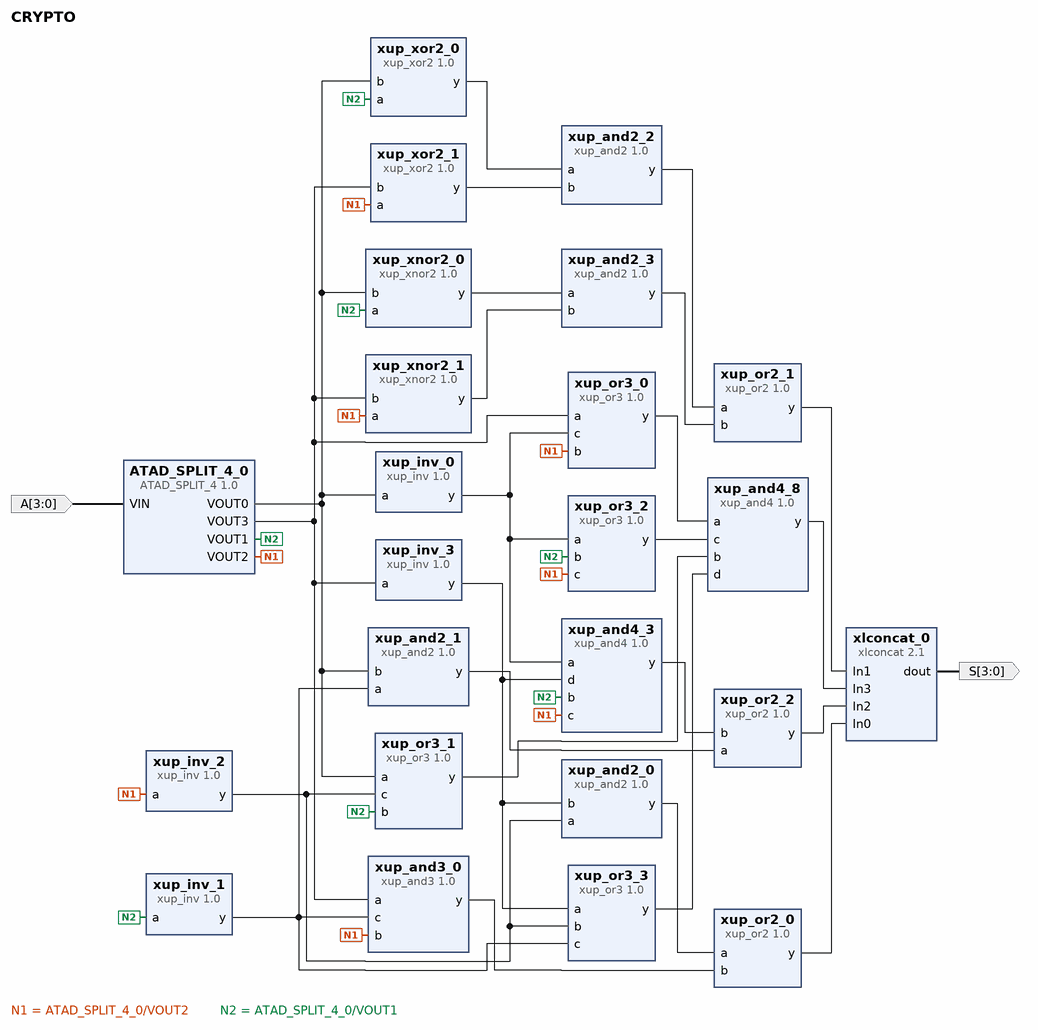
[diagram p0: block diagram of the top level]
# Vivado block design CRYPTO, xc7a100tcsg324-1, Vivado 2020.1
create_bd_design CRYPTO

create_bd_port -dir I -from 3 -to 0 A
create_bd_port -dir O -from 3 -to 0 S

create_bd_cell -type ip -vlnv xilinx.com:user:ATAD_SPLIT_4:1.0 ATAD_SPLIT_4_0
create_bd_cell -type ip -vlnv xilinx.com:ip:xlconcat:2.1 xlconcat_0
set_property -dict {CONFIG.NUM_PORTS 4} [get_bd_cells xlconcat_0]
create_bd_cell -type ip -vlnv xilinx.com:xup:xup_or2:1.0 xup_or2_0
create_bd_cell -type ip -vlnv xilinx.com:xup:xup_and2:1.0 xup_and2_0
create_bd_cell -type ip -vlnv xilinx.com:xup:xup_and3:1.0 xup_and3_0
create_bd_cell -type ip -vlnv xilinx.com:xup:xup_inv:1.0 xup_inv_0
create_bd_cell -type ip -vlnv xilinx.com:xup:xup_inv:1.0 xup_inv_1
create_bd_cell -type ip -vlnv xilinx.com:xup:xup_inv:1.0 xup_inv_2
create_bd_cell -type ip -vlnv xilinx.com:xup:xup_inv:1.0 xup_inv_3
create_bd_cell -type ip -vlnv xilinx.com:xup:xup_and4:1.0 xup_and4_3
create_bd_cell -type ip -vlnv xilinx.com:xup:xup_and2:1.0 xup_and2_1
create_bd_cell -type ip -vlnv xilinx.com:xup:xup_or2:1.0 xup_or2_2
create_bd_cell -type ip -vlnv xilinx.com:xup:xup_and4:1.0 xup_and4_8
create_bd_cell -type ip -vlnv xilinx.com:xup:xup_or3:1.0 xup_or3_0
create_bd_cell -type ip -vlnv xilinx.com:xup:xup_or3:1.0 xup_or3_1
create_bd_cell -type ip -vlnv xilinx.com:xup:xup_or3:1.0 xup_or3_2
create_bd_cell -type ip -vlnv xilinx.com:xup:xup_or3:1.0 xup_or3_3
create_bd_cell -type ip -vlnv xilinx.com:xup:xup_xor2:1.0 xup_xor2_0
create_bd_cell -type ip -vlnv xilinx.com:xup:xup_xor2:1.0 xup_xor2_1
create_bd_cell -type ip -vlnv xilinx.com:xup:xup_xnor2:1.0 xup_xnor2_0
create_bd_cell -type ip -vlnv xilinx.com:xup:xup_xnor2:1.0 xup_xnor2_1
create_bd_cell -type ip -vlnv xilinx.com:xup:xup_or2:1.0 xup_or2_1
create_bd_cell -type ip -vlnv xilinx.com:xup:xup_and2:1.0 xup_and2_2
create_bd_cell -type ip -vlnv xilinx.com:xup:xup_and2:1.0 xup_and2_3

# ---- connections ----

connect_bd_net [get_bd_pins xup_or2_0/y] [get_bd_pins xlconcat_0/In0]
connect_bd_net [get_bd_pins xup_and2_0/y] [get_bd_pins xup_or2_0/a]
connect_bd_net [get_bd_pins xup_and3_0/y] [get_bd_pins xup_or2_0/b]
connect_bd_net [get_bd_ports A] [get_bd_pins ATAD_SPLIT_4_0/VIN]
connect_bd_net [get_bd_pins ATAD_SPLIT_4_0/VOUT3] \
  [get_bd_pins xup_inv_3/a] [get_bd_pins xup_and3_0/a] [get_bd_pins xup_or3_0/a] [get_bd_pins xup_xor2_1/b] \
  [get_bd_pins xup_xnor2_1/b]
connect_bd_net [get_bd_pins ATAD_SPLIT_4_0/VOUT2] \
  [get_bd_pins xup_inv_2/a] [get_bd_pins xup_and3_0/b] [get_bd_pins xup_and4_3/c] [get_bd_pins xup_or3_0/b] \
  [get_bd_pins xup_or3_2/c] [get_bd_pins xup_xor2_1/a] [get_bd_pins xup_xnor2_1/a]
connect_bd_net [get_bd_pins xup_inv_3/y] [get_bd_pins xup_and2_0/b] [get_bd_pins xup_and4_3/d] [get_bd_pins xup_or3_3/a]
connect_bd_net [get_bd_pins xup_inv_2/y] [get_bd_pins xup_and2_0/a] [get_bd_pins xup_or3_1/c] [get_bd_pins xup_or3_3/b]
connect_bd_net [get_bd_pins ATAD_SPLIT_4_0/VOUT1] \
  [get_bd_pins xup_inv_1/a] [get_bd_pins xup_and4_3/b] [get_bd_pins xup_or3_1/b] [get_bd_pins xup_or3_2/b] \
  [get_bd_pins xup_xor2_0/a] [get_bd_pins xup_xnor2_0/a]
connect_bd_net [get_bd_pins xup_inv_1/y] [get_bd_pins xup_and3_0/c] [get_bd_pins xup_and2_1/a] [get_bd_pins xup_or3_3/c]
connect_bd_net [get_bd_pins xlconcat_0/dout] [get_bd_ports S]
connect_bd_net [get_bd_pins ATAD_SPLIT_4_0/VOUT0] \
  [get_bd_pins xup_inv_0/a] [get_bd_pins xup_and2_1/b] [get_bd_pins xup_or3_1/a] [get_bd_pins xup_xor2_0/b] \
  [get_bd_pins xup_xnor2_0/b]
connect_bd_net [get_bd_pins xup_inv_0/y] [get_bd_pins xup_and4_3/a] [get_bd_pins xup_or3_0/c] [get_bd_pins xup_or3_2/a]
connect_bd_net [get_bd_pins xup_and4_3/y] [get_bd_pins xup_or2_2/b]
connect_bd_net [get_bd_pins xup_and2_1/y] [get_bd_pins xup_or2_2/a]
connect_bd_net [get_bd_pins xup_or2_2/y] [get_bd_pins xlconcat_0/In2]
connect_bd_net [get_bd_pins xup_or3_0/y] [get_bd_pins xup_and4_8/a]
connect_bd_net [get_bd_pins xup_or3_1/y] [get_bd_pins xup_and4_8/b]
connect_bd_net [get_bd_pins xup_or3_2/y] [get_bd_pins xup_and4_8/c]
connect_bd_net [get_bd_pins xup_or3_3/y] [get_bd_pins xup_and4_8/d]
connect_bd_net [get_bd_pins xup_and4_8/y] [get_bd_pins xlconcat_0/In3]
connect_bd_net [get_bd_pins xup_or2_1/y] [get_bd_pins xlconcat_0/In1]
connect_bd_net [get_bd_pins xup_xor2_0/y] [get_bd_pins xup_and2_2/a]
connect_bd_net [get_bd_pins xup_xor2_1/y] [get_bd_pins xup_and2_2/b]
connect_bd_net [get_bd_pins xup_xnor2_0/y] [get_bd_pins xup_and2_3/a]
connect_bd_net [get_bd_pins xup_xnor2_1/y] [get_bd_pins xup_and2_3/b]
connect_bd_net [get_bd_pins xup_and2_2/y] [get_bd_pins xup_or2_1/a]
connect_bd_net [get_bd_pins xup_and2_3/y] [get_bd_pins xup_or2_1/b]

validate_bd_design
save_bd_design
